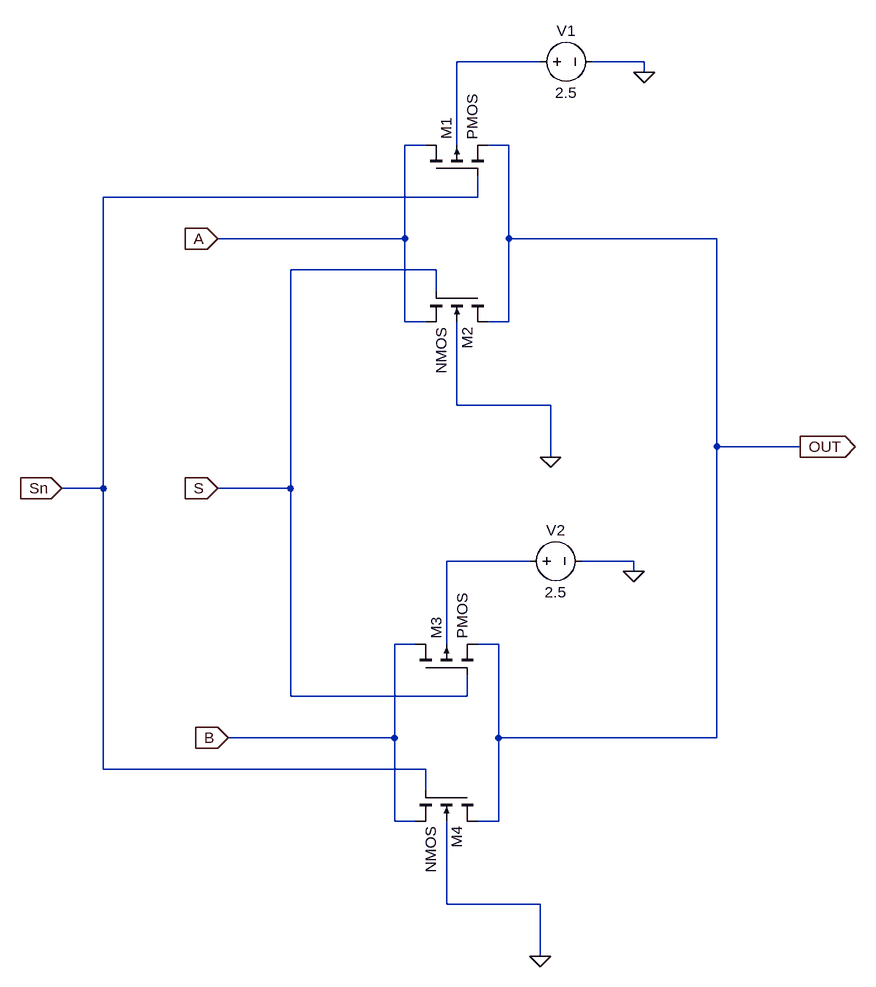
[diagram p0: schematic mux.asc]
mux.asc, the LTspice schematic file:
Version 4
SHEET 1 880 1188
WIRE 272 -208 144 -208
WIRE 432 -208 352 -208
WIRE 432 -192 432 -208
WIRE 96 -80 64 -80
WIRE 144 -80 144 -208
WIRE 224 -80 192 -80
WIRE 176 0 176 -32
WIRE 176 0 -400 0
WIRE 64 64 64 -80
WIRE 64 64 -224 64
WIRE 224 64 224 -80
WIRE 544 64 224 64
WIRE 112 112 -112 112
WIRE 112 144 112 112
WIRE 64 192 64 64
WIRE 96 192 64 192
WIRE 224 192 224 64
WIRE 224 192 192 192
WIRE 144 320 144 192
WIRE 288 320 144 320
WIRE 544 384 544 64
WIRE 672 384 544 384
WIRE 288 400 288 320
WIRE -400 448 -400 0
WIRE -400 448 -464 448
WIRE -112 448 -112 112
WIRE -112 448 -224 448
WIRE 256 560 128 560
WIRE 416 560 336 560
WIRE 416 576 416 560
WIRE 80 688 48 688
WIRE 128 688 128 560
WIRE 208 688 176 688
WIRE -112 768 -112 448
WIRE 160 768 160 736
WIRE 160 768 -112 768
WIRE 48 832 48 688
WIRE 48 832 -208 832
WIRE 208 832 208 688
WIRE 544 832 544 384
WIRE 544 832 208 832
WIRE -400 880 -400 448
WIRE 96 880 -400 880
WIRE 96 912 96 880
WIRE 48 960 48 832
WIRE 80 960 48 960
WIRE 208 960 208 832
WIRE 208 960 176 960
WIRE 128 1088 128 960
WIRE 272 1088 128 1088
WIRE 272 1168 272 1088
FLAG 432 -192 0
FLAG 288 400 0
FLAG 416 576 0
FLAG 272 1168 0
FLAG -224 448 S
IOPIN -224 448 In
FLAG -224 64 A
IOPIN -224 64 In
FLAG -208 832 B
IOPIN -208 832 In
FLAG -464 448 Sn
IOPIN -464 448 In
FLAG 672 384 OUT
IOPIN 672 384 Out
SYMBOL pmos4 96 -32 R270
SYMATTR InstName M1
SYMATTR Value2 l=2.4u w=10.8u
SYMBOL nmos4 192 144 R90
SYMATTR InstName M2
SYMATTR Value2 l=2.4u w=3.6u
SYMBOL voltage 256 -208 R270
WINDOW 0 32 56 VTop 2
WINDOW 3 -32 56 VBottom 2
WINDOW 123 0 0 Left 2
WINDOW 39 0 0 Left 2
SYMATTR InstName V1
SYMATTR Value 2.5
SYMBOL pmos4 80 736 R270
SYMATTR InstName M3
SYMATTR Value2 l=2.4u w=10.8u
SYMBOL nmos4 176 912 R90
SYMATTR InstName M4
SYMATTR Value2 l=2.4u w=3.6u
SYMBOL voltage 240 560 R270
WINDOW 0 32 56 VTop 2
WINDOW 3 -32 56 VBottom 2
WINDOW 123 0 0 Left 2
WINDOW 39 0 0 Left 2
SYMATTR InstName V2
SYMATTR Value 2.5

The netlist it stands for:
* mux.asc
M1 A Sn OUT N001 PMOS l=2.4u w=10.8u
M2 OUT S A 0 NMOS l=2.4u w=3.6u
V1 N001 0 2.5
M3 B S OUT N002 PMOS l=2.4u w=10.8u
M4 OUT Sn B 0 NMOS l=2.4u w=3.6u
V2 N002 0 2.5
.model NMOS NMOS
.model PMOS PMOS
.lib standard.mos
.backanno
.end